# Altium schematic sheet ESPSmartPlug1.SchDoc
size A
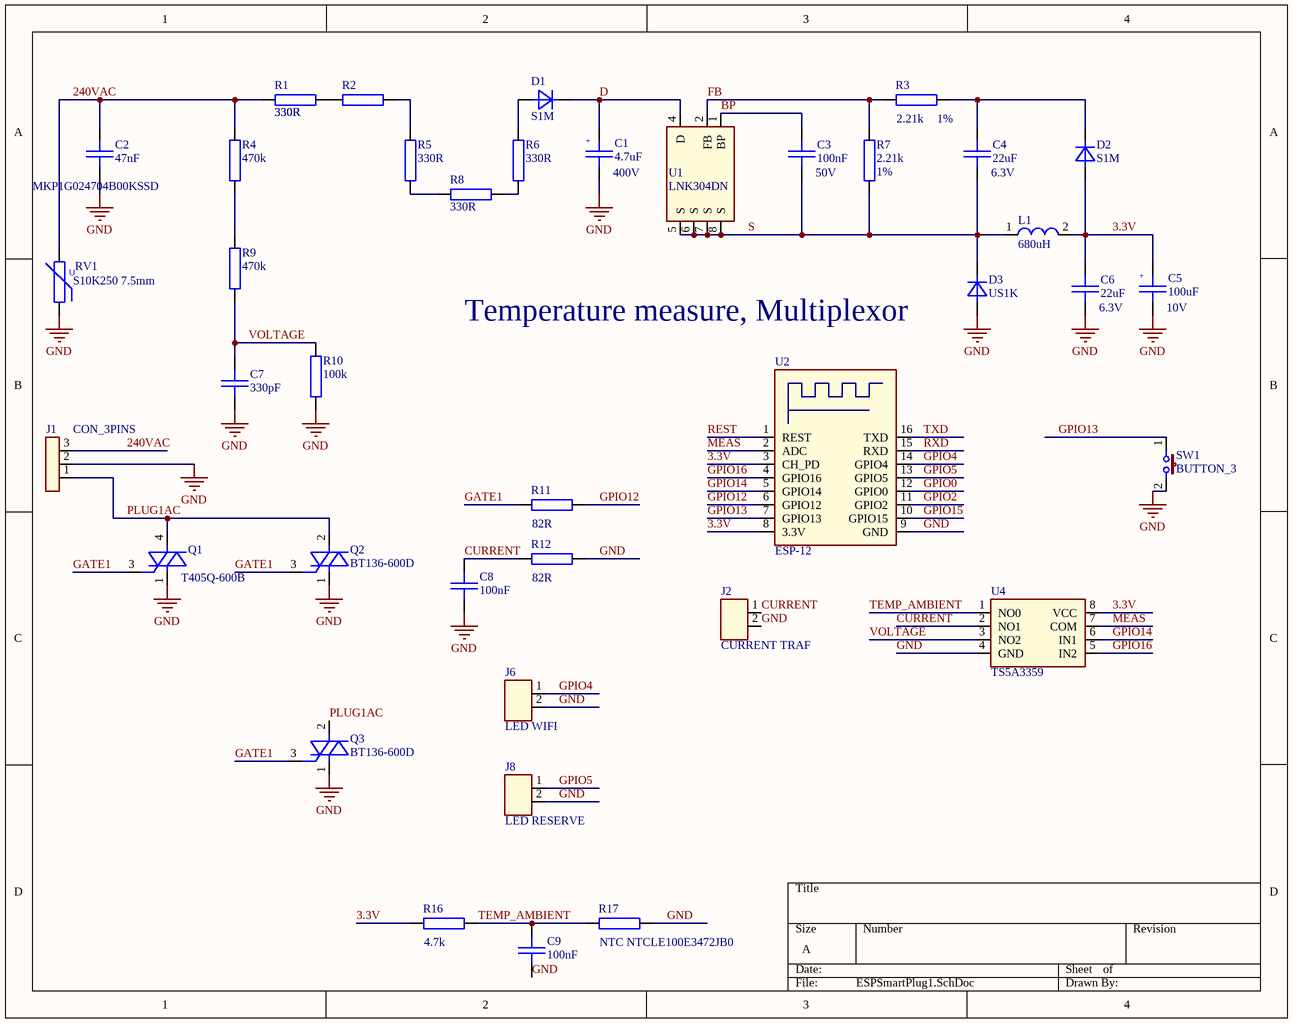
[diagram p0: ESPSmartPlug1.SchDoc]

## Parts
C1  4.7uF  VOLTAGE: 400V  [SMD_CAPAE1030X1050N]
C2  47nF  MANUFACTURER_NUMBER: MKP1G024704B00KSSD  [PTH_CAPA1500-630X1850X1550]
C3  100nF  VOLTAGE: 50V  [SMD_0603_CAPC1608X95N]
C4  22uF  VOLTAGE: 6.3V  [SMD_0805_CAPC2012X95N]
C5  100uF  VOLTAGE: 10V  [SMD_CAPAE660X550N]
C6  22uF  VOLTAGE: 6.3V  [SMD_0805_CAPC2012X95N]
C7  330pF  [SMD_0603_CAPC1608X95N]
C8  100nF  [SMD_0805_CAPC2012X95N]
C9  100nF  [SMD_0603_CAPC1608X95N]
D1  S1M  [SMD_DO214AC_SMA]
D2  S1M  [SMD_DO214AC_SMA]
D3  US1K  [SMD_DO214AC_SMA]
J1  CON_3PINS  [PTH_HDRV03W11060P500_1X03]
J2  CURRENT TRAF  [PTH_HDRV02W64P254_1X02]
J6  LED WIFI  [SMD_LED_LAA67F]
J8  LED RESERVE  [SMD_LED_LAA67F]
L1  680uH  [SMD_INDC101101X480N]
Q1  T405Q-600B  [SMD_TO229P991X239-4N_DPAK]
Q2  BT136-600D  [PTH_TO220AB]
Q3  BT136-600D  [PTH_TO220AB]
R1  330R  [SMD_1206_RESC3216X102N]
R2  330R  [SMD_1206_RESC3216X102N]
R3  2.21k  TOLERANCE: 1%  [SMD_0603_RESC1608X55N]
R4  470k  [SMD_1206_RESC3216X102N]
R5  330R  [SMD_1206_RESC3216X102N]
R6  330R  [SMD_1206_RESC3216X102N]
R7  2.21k  TOLERANCE: 1%  [SMD_0603_RESC1608X55N]
R8  330R  [SMD_1206_RESC3216X102N]
R9  470k  [SMD_1206_RESC3216X102N]
R10  100k  [SMD_0603_RESC1608X55N]
R11  82R  [SMD_0603_RESC1608X55N]
R12  82R  [SMD_0603_RESC1608X55N]
R16  4.7k  [SMD_0603_RESC1608X55N]
R17  NTC NTCLE100E3472JB0  [PTH_CAPRR500W60L500T400H800A]
RV1  S10K250 7.5mm  [PTH_VAR_S10K275]
SW1  BUTTON_3  [PTH_SWI_TACT-TS6601V]
U1  LNK304DN  [SMD_SOIC127P600X175-7N]
U2  ESP-12  [SMD_MOD_ESP_12]
U4  TS5A3359  [SMD_SOT765-1_SOP50P310X100-8N]

## Nets
GND: C1.2 C2.2 C5.2 C6.2 C7.2 C8.2 C9.2 D3.2(A) J1.2 J2.2 J6.2 J8.2 Q1.1(T1) Q2.1(T1) Q3.1(T1) R10.1 R12.2 R17.2 RV1.2 SW1.2 U2.9(GND) U4.4(GND)
3.3V: C5.1 C6.1 D2.2(A) L1.2 R16.1 U2.3(CH_PD) U2.8(3.3V) U4.8(VCC)
240VAC: C2.1 J1.3 R1.2 R4.2 RV1.1
BP: C3.1 U1.1(BP)
CURRENT: C8.1 J2.1 R12.1 U4.2(NO1)
D: C1.1 D1.1(C) U1.4(D)
FB: R3.1 R7.1 U1.2(FB)
GATE1: Q1.3(G) Q2.3(G) Q3.3(G) R11.1
GPIO0: U2.12(GPIO0)
GPIO2: U2.11(GPIO2)
GPIO4: J6.1 U2.14(GPIO4)
GPIO5: J8.1 U2.13(GPIO5)
GPIO12: R11.2 U2.6(GPIO12)
GPIO13: SW1.1 U2.7(GPIO13)
GPIO14: U2.5(GPIO14) U4.6(IN1)
GPIO15: U2.10(GPIO15)
GPIO16: U2.4(GPIO16) U4.5(IN2)
MEAS: U2.2(ADC) U4.7(COM)
PLUG1AC: J1.1 Q1.4(T2) Q2.2(T2) Q3.2(T2)
REST: U2.1(REST)
RXD: U2.15(RXD)
S: C3.2 C4.2 D3.1(C) L1.1 R7.2 U1.5(S) U1.6(S) U1.7(S) U1.8(S)
TEMP_AMBIENT: C9.1 R16.2 R17.1 U4.1(NO0)
TXD: U2.16(TXD)
VOLTAGE: C7.1 R9.1 R10.2 U4.3(NO2)
NetC4_1: C4.1 D2.1(C) R3.2
NetD1_2: D1.2(A) R6.1
NetR1_1: R1.1 R2.2
NetR2_1: R2.1 R5.2
NetR4_1: R4.1 R9.2
NetR5_1: R5.1 R8.1
NetR6_2: R6.2 R8.2

## Notes on the sheet
- (near D3) Temperature measure, Multiplexor
- (in symbol C_POL) +
- (in symbol VARISTOR) U

## Library data of the parts
C1 C5 = C_POL
C2 = C: 47nF 310V; NOTE: <NOTE>
C3 C4 C6-C9 = C: NOTE: <NOTE>
D1-D3 = D: NOTE: <NOTE>
J2 J6 J8 = CON_2PINS: NOTE: <NOTE>
L1 = L
Q1 = THYR_T11G3T24: NOTE: <NOTE>
Q2 Q3 = THYR_T11T22G3: NOTE: <NOTE>
R1-R10 = R: NOTE: <NOTE>; R_BDS: R
R11 R12 R16 R17 = R: NOTE: <NOTE>; TOLERANCE: 5%; R_BDS: R
RV1 = VARISTOR: NOTE: <NOTE>; R_BDS: R
U1 = IC_LNK302-306D_SO-8C: NOTE: <NOTE>
U2 = MOD_ESP-12
U4 = IC_TS5A3359: Analog Multiplexor 3-Channel; NOTE: <NOTE>